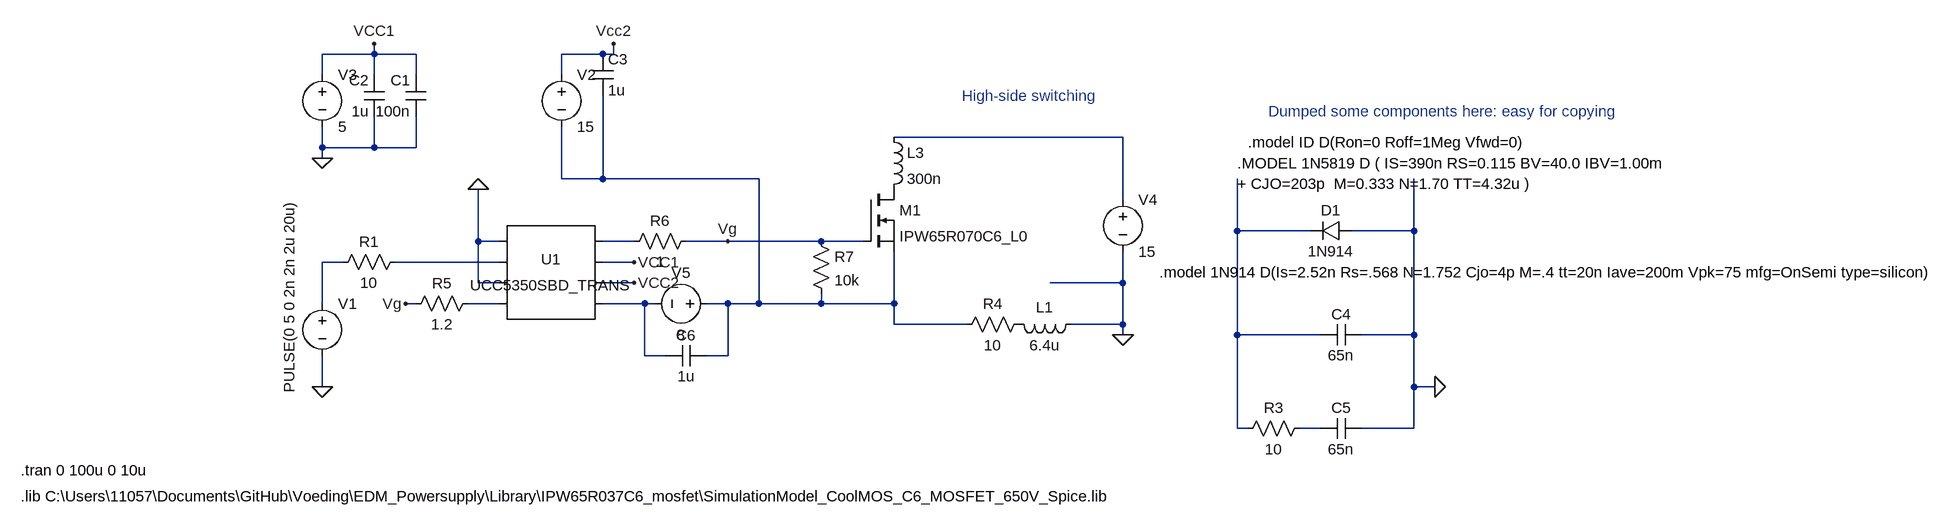
[diagram p0: schematic EDM_Powersupply_V4.asc]
EDM_Powersupply_V4.asc, the LTspice schematic file:
Version 4
SHEET 1 1876 680
WIRE -176 -160 -176 -176
WIRE -176 -160 -256 -160
WIRE -112 -160 -176 -160
WIRE 176 -160 112 -160
WIRE 192 -160 192 -176
WIRE 192 -160 176 -160
WIRE -256 -128 -256 -160
WIRE -176 -128 -176 -160
WIRE -112 -128 -112 -160
WIRE 112 -128 112 -160
WIRE 976 -32 624 -32
WIRE -256 -16 -256 -48
WIRE -176 -16 -176 -64
WIRE -176 -16 -256 -16
WIRE -112 -16 -112 -64
WIRE -112 -16 -176 -16
WIRE -256 0 -256 -16
WIRE 112 32 112 -48
WIRE 176 32 176 -96
WIRE 176 32 112 32
WIRE 416 32 176 32
WIRE 976 64 976 -32
WIRE 1152 112 1152 32
WIRE 1264 112 1152 112
WIRE 1424 112 1424 32
WIRE 1424 112 1328 112
WIRE -16 128 -16 48
WIRE 16 128 -16 128
WIRE 224 128 176 128
WIRE 368 128 304 128
WIRE 512 128 368 128
WIRE 576 128 512 128
WIRE -224 160 -256 160
WIRE 16 160 -144 160
WIRE 224 160 176 160
WIRE -16 192 -16 128
WIRE 16 192 -16 192
WIRE 224 192 176 192
WIRE 976 192 976 144
WIRE 976 192 864 192
WIRE -256 224 -256 160
WIRE -112 224 -128 224
WIRE 16 224 -32 224
WIRE 240 224 176 224
WIRE 256 224 240 224
WIRE 368 224 336 224
WIRE 416 224 416 32
WIRE 416 224 368 224
WIRE 512 224 512 208
WIRE 512 224 416 224
WIRE 624 224 624 144
WIRE 624 224 512 224
WIRE 624 256 624 224
WIRE 736 256 624 256
WIRE 976 256 976 192
WIRE 976 256 896 256
WIRE 976 272 976 256
WIRE 1152 272 1152 112
WIRE 1280 272 1152 272
WIRE 1424 272 1424 112
WIRE 1424 272 1344 272
WIRE 240 304 240 224
WIRE 272 304 240 304
WIRE 368 304 368 224
WIRE 368 304 336 304
WIRE -256 352 -256 304
WIRE 1424 352 1424 272
WIRE 1456 352 1424 352
WIRE 1152 416 1152 272
WIRE 1168 416 1152 416
WIRE 1280 416 1248 416
WIRE 1424 416 1424 352
WIRE 1424 416 1344 416
FLAG -256 352 0
FLAG -256 0 0
FLAG 224 192 VCC2
FLAG 192 -176 Vcc2
FLAG 224 160 VCC1
FLAG -176 -176 VCC1
FLAG 368 128 Vg
FLAG -128 224 Vg
FLAG -16 48 0
FLAG 976 272 0
FLAG 1456 352 0
SYMBOL AutoGenerated\\UCC5350SBD_TRANS 96 176 R0
SYMATTR InstName U1
SYMBOL voltage -256 208 R0
WINDOW 123 0 0 Left 0
WINDOW 39 0 0 Left 0
WINDOW 3 -51 153 VLeft 2
SYMATTR Value PULSE(0 5 0 2n 2n 2u 20u)
SYMATTR InstName V1
SYMBOL voltage 112 -144 R0
WINDOW 123 0 0 Left 0
WINDOW 39 0 0 Left 0
SYMATTR InstName V2
SYMATTR Value 15
SYMBOL cap -96 -64 R180
WINDOW 0 24 56 Left 2
WINDOW 3 24 8 Left 2
SYMATTR InstName C1
SYMATTR Value 100n
SYMBOL cap -160 -64 R180
WINDOW 0 24 56 Left 2
WINDOW 3 24 8 Left 2
SYMATTR InstName C2
SYMATTR Value 1u
SYMBOL voltage -256 -144 R0
WINDOW 123 0 0 Left 0
WINDOW 39 0 0 Left 0
SYMATTR InstName V3
SYMATTR Value 5
SYMBOL res -128 144 R90
WINDOW 0 0 56 VBottom 2
WINDOW 3 32 56 VTop 2
SYMATTR InstName R1
SYMATTR Value 10
SYMBOL res 720 272 R270
WINDOW 0 32 56 VTop 2
WINDOW 3 0 56 VBottom 2
SYMATTR InstName R4
SYMATTR Value 10
SYMBOL voltage 976 48 R0
WINDOW 123 0 0 Left 0
WINDOW 39 0 0 Left 0
SYMATTR InstName V4
SYMATTR Value 15
SYMBOL res -16 208 R90
WINDOW 0 0 56 VBottom 2
WINDOW 3 32 56 VTop 2
SYMATTR InstName R5
SYMATTR Value 1.2
SYMBOL res 320 112 R90
WINDOW 0 0 56 VBottom 2
WINDOW 3 32 56 VTop 2
SYMATTR InstName R6
SYMATTR Value 1
SYMBOL nmos 576 48 R0
SYMATTR InstName M1
SYMATTR Value IPW65R070C6_L0
SYMATTR Prefix X
SYMBOL cap 1344 256 R90
WINDOW 0 0 32 VBottom 2
WINDOW 3 32 32 VTop 2
SYMATTR InstName C4
SYMATTR Value 65n
SYMBOL diode 1328 96 R90
WINDOW 0 0 32 VBottom 2
WINDOW 3 32 32 VTop 2
SYMATTR InstName D1
SYMATTR Value 1N914
SYMBOL cap 1344 400 R90
WINDOW 0 0 32 VBottom 2
WINDOW 3 32 32 VTop 2
SYMATTR InstName C5
SYMATTR Value 65n
SYMBOL res 1264 400 R90
WINDOW 0 0 56 VBottom 2
WINDOW 3 32 56 VTop 2
SYMATTR InstName R3
SYMATTR Value 10
SYMBOL res 496 112 R0
SYMATTR InstName R7
SYMATTR Value 10k
SYMBOL cap 160 -160 R0
SYMATTR InstName C3
SYMATTR Value 1u
SYMBOL voltage 352 224 R90
WINDOW 0 -32 56 VBottom 2
WINDOW 3 32 56 VTop 2
WINDOW 123 0 0 Left 0
WINDOW 39 0 0 Left 0
SYMATTR InstName V5
SYMATTR Value 8
SYMBOL cap 336 288 R90
WINDOW 0 0 32 VBottom 2
WINDOW 3 32 32 VTop 2
SYMATTR InstName C6
SYMATTR Value 1u
SYMBOL ind 912 240 R90
WINDOW 0 5 56 VBottom 2
WINDOW 3 32 56 VTop 2
SYMATTR InstName L1
SYMATTR Value 6.4u
SYMBOL ind 608 -48 R0
SYMATTR InstName L3
SYMATTR Value 300n
TEXT -720 520 Left 2 !.lib C:\\Users\\11057\\Documents\\GitHub\\Voeding\\EDM_Powersupply\\Library\\IPW65R037C6_mosfet\\SimulationModel_CoolMOS_C6_MOSFET_650V_Spice.lib
TEXT -720 480 Left 2 !.tran 0 100u 0 10u
TEXT 728 -96 Left 2 ;High-side switching
TEXT 1032 176 Left 2 !.model 1N914 D(Is=2.52n Rs=.568 N=1.752 Cjo=4p M=.4 tt=20n Iave=200m Vpk=75 mfg=OnSemi type=silicon)
TEXT 1168 -24 Left 2 !.model ID D(Ron=0 Roff=1Meg Vfwd=0)
TEXT 1200 -72 Left 2 ;Dumped some components here: easy for copying
TEXT 1152 8 Left 2 !.MODEL 1N5819 D ( IS=390n RS=0.115 BV=40.0 IBV=1.00m\n+ CJO=203p  M=0.333 N=1.70 TT=4.32u )

The netlist it stands for:
* EDM_Powersupply_V4.asc
* U1: UCC5350SBD_TRANS (symbol AutoGenerated\UCC5350SBD_TRANS not available, pins judged from their places): pin1=0 pin2=N006 pin3=0 pin4=N007 pin5=N004 pin6=VCC1 pin7=VCC2 pin8=N008
V1 N005 0 PULSE(0 5 0 2n 2n 2u 20u)
V2 VCC2 N002 15
C1 0 VCC1 100n
C2 0 VCC1 1u
V3 VCC1 0 5
R1 N006 N005 10
R4 N002 P001 10
V4 N001 0 15
R5 N007 Vg 1.2
R6 Vg N004 1
XM1 P002 Vg N002 IPW65R070C6_L0  ; pins D G S
C4 0 N003 65n
D1 0 N003 1N914
C5 0 N009 65n
R3 N009 N003 10
R7 Vg N002 10k
C3 VCC2 N002 1u
V5 N002 N008 8
C6 N002 N008 1u
L1 0 P001 6.4u
L3 N001 P002 300n
.model D D
.lib standard.dio
.lib C:\Users\11057\Documents\GitHub\Voeding\EDM_Powersupply\Library\IPW65R037C6_mosfet\SimulationModel_CoolMOS_C6_MOSFET_650V_Spice.lib
.tran 0 100u 0 10u
* High-side switching
.model 1N914 D(Is=2.52n Rs=.568 N=1.752 Cjo=4p M=.4 tt=20n Iave=200m Vpk=75 mfg=OnSemi type=silicon)
.model ID D(Ron=0 Roff=1Meg Vfwd=0)
* Dumped some components here: easy for copying
.MODEL 1N5819 D ( IS=390n RS=0.115 BV=40.0 IBV=1.00m
+ CJO=203p  M=0.333 N=1.70 TT=4.32u )
.backanno
.end